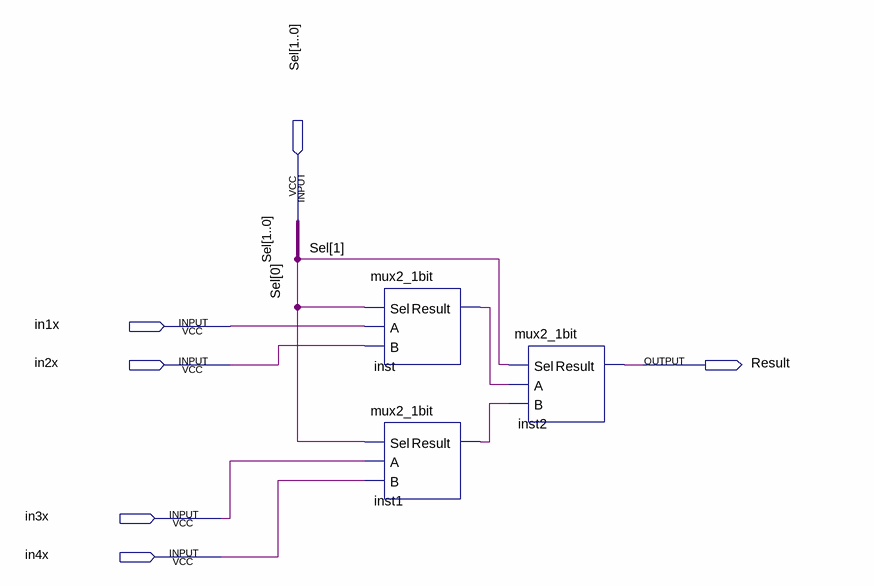
[diagram p0: schematic sheet]
// Quartus schematic mux4_1bit.bdf as structural Verilog: 3 symbols, 6 pins
module mux4_1bit (
  input  [1:0] Sel,
  input  in1x,
  input  in2x,
  input  in3x,
  input  in4x,
  output Result
);

  wire inst1_result, inst_result;

  mux2_1bit inst (.Sel(Sel[0]), .A(in1x), .B(in2x), .Result(inst_result));
  mux2_1bit inst1 (.Sel(Sel[0]), .A(in3x), .B(in4x), .Result(inst1_result));
  mux2_1bit inst2 (.Sel(Sel[1]), .A(inst_result), .B(inst1_result), .Result(Result));
endmodule
